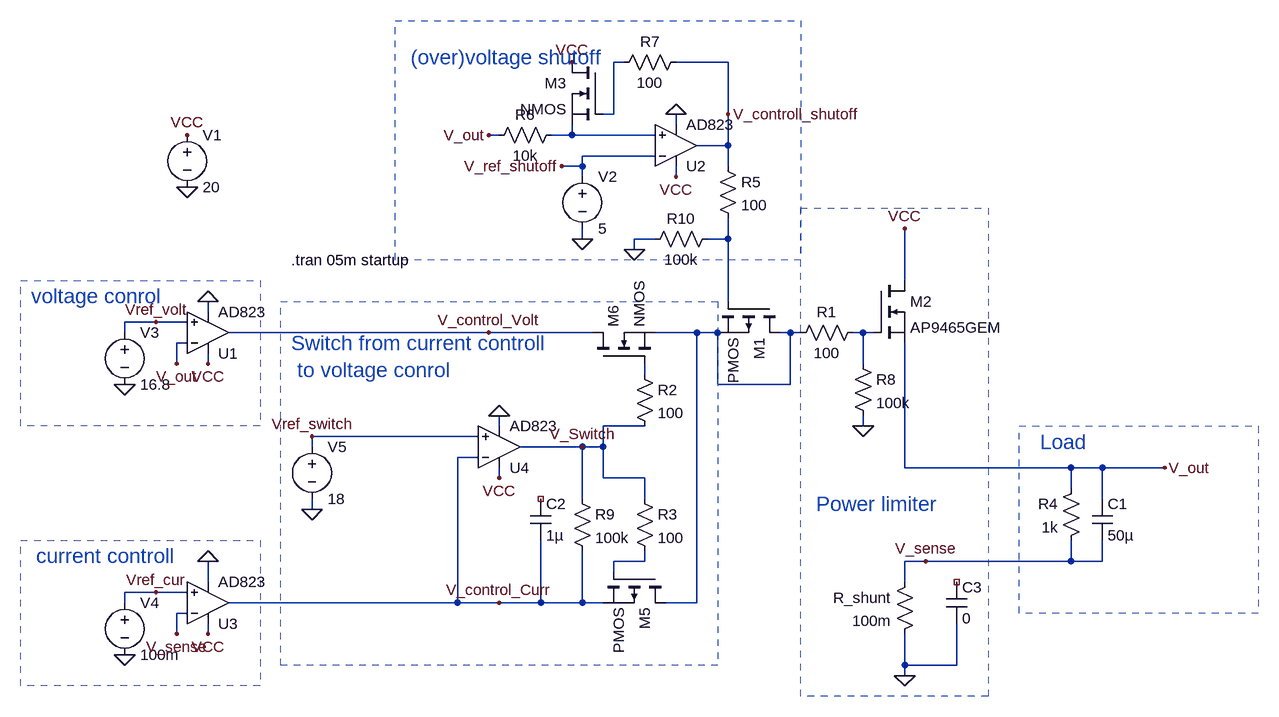
[diagram p0: schematic Lap_Power_supply.asc]
Lap_Power_supply.asc, the LTspice schematic file:
Version 4
SHEET 1 1484 1084
WIRE 400 -240 384 -240
WIRE 560 -240 480 -240
WIRE 384 -160 384 -240
WIRE 384 -160 368 -160
WIRE 560 -160 560 -240
WIRE 480 -144 480 -160
WIRE 208 -128 192 -128
WIRE 320 -128 320 -144
WIRE 320 -128 288 -128
WIRE 448 -128 320 -128
WIRE 560 -112 560 -160
WIRE 560 -112 512 -112
WIRE 448 -96 336 -96
WIRE 336 -80 336 -96
WIRE 336 -80 304 -80
WIRE 560 -80 560 -112
WIRE 336 -64 336 -80
WIRE 480 -64 480 -80
WIRE 336 32 336 16
WIRE 448 32 416 32
WIRE 560 32 560 0
WIRE 560 32 528 32
WIRE 416 48 416 32
WIRE 832 96 832 16
WIRE 560 128 560 32
WIRE -240 144 -240 128
WIRE -320 160 -368 160
WIRE -272 160 -320 160
WIRE -368 176 -368 160
WIRE 192 176 -208 176
WIRE 352 176 192 176
WIRE 512 176 448 176
WIRE 544 176 512 176
WIRE 656 176 640 176
WIRE 672 176 656 176
WIRE 768 176 752 176
WIRE 784 176 768 176
WIRE -272 192 -288 192
WIRE -288 224 -288 192
WIRE -240 224 -240 208
WIRE 768 224 768 176
WIRE 432 240 432 224
WIRE 544 256 544 176
WIRE 656 256 656 176
WIRE 656 256 544 256
WIRE 208 320 208 304
WIRE 432 320 368 320
WIRE 768 320 768 304
WIRE 176 336 -80 336
WIRE -80 352 -80 336
WIRE 336 352 240 352
WIRE 368 352 368 320
WIRE 368 352 336 352
WIRE 176 368 144 368
WIRE 832 384 832 192
WIRE 1088 384 832 384
WIRE 1136 384 1088 384
WIRE 1232 384 1136 384
WIRE 208 400 208 384
WIRE 368 400 368 352
WIRE 432 400 368 400
WIRE 1088 416 1088 384
WIRE 336 432 336 352
WIRE 432 432 432 400
WIRE 1136 432 1136 384
WIRE -80 448 -80 432
WIRE 432 528 432 512
WIRE 432 528 384 528
WIRE 864 528 832 528
WIRE 1088 528 1088 496
WIRE 1088 528 864 528
WIRE 1136 528 1136 496
WIRE 1136 528 1088 528
WIRE 384 544 384 528
WIRE -240 560 -240 528
WIRE 832 560 832 528
WIRE -320 576 -368 576
WIRE -272 576 -320 576
WIRE -368 592 -368 576
WIRE 144 592 144 368
WIRE 144 592 -208 592
WIRE 208 592 144 592
WIRE 272 592 272 496
WIRE 272 592 208 592
WIRE 336 592 336 512
WIRE 336 592 272 592
WIRE 368 592 336 592
WIRE 512 592 512 176
WIRE 512 592 464 592
WIRE -272 608 -288 608
WIRE -288 640 -288 608
WIRE -240 640 -240 624
WIRE 832 688 832 640
WIRE 912 688 912 624
WIRE 912 688 832 688
WIRE 832 704 832 688
FLAG 832 704 0
FLAG -240 128 0
FLAG 832 16 VCC
FLAG -240 224 VCC
FLAG -272 -128 VCC
FLAG -272 -48 0
FLAG -320 160 Vref_volt
FLAG 1232 384 V_out
FLAG -288 224 V_out
FLAG 864 528 V_sense
FLAG -368 256 0
FLAG -240 528 0
FLAG -240 640 VCC
FLAG -320 576 Vref_cur
FLAG -288 640 V_sense
FLAG -368 672 0
FLAG 208 304 0
FLAG 208 400 VCC
FLAG -80 336 Vref_switch
FLAG -80 448 0
FLAG 768 320 0
FLAG 336 352 V_Switch
FLAG 208 592 V_control_Curr
FLAG 192 176 V_control_Volt
FLAG 480 -160 0
FLAG 480 -64 VCC
FLAG 192 -128 V_out
FLAG 336 32 0
FLAG 304 -80 V_ref_shutoff
FLAG 560 -160 V_controll_shutoff
FLAG 416 48 0
FLAG 320 -240 VCC
SYMBOL res 768 160 R90
WINDOW 0 0 56 VBottom 2
WINDOW 3 32 56 VTop 2
SYMATTR InstName R1
SYMATTR Value 100
SYMBOL res 1104 400 M0
SYMATTR InstName R4
SYMATTR Value 1k
SYMBOL voltage -272 -144 R0
SYMATTR InstName V1
SYMATTR Value 20
SYMBOL res 848 544 M0
SYMATTR InstName R_shunt
SYMATTR Value 100m
SYMBOL OpAmps\\AD823 -240 240 M180
SYMATTR InstName U1
SYMBOL voltage -368 160 R0
SYMATTR InstName V3
SYMATTR Value 16.8
SYMBOL nmos 784 96 R0
SYMATTR InstName M2
SYMATTR Value AP9465GEM
SYMBOL res 416 224 R0
SYMATTR InstName R2
SYMATTR Value 100
SYMBOL OpAmps\\AD823 -240 656 M180
SYMATTR InstName U3
SYMBOL voltage -368 576 R0
SYMATTR InstName V4
SYMATTR Value 100m
SYMBOL OpAmps\\AD823 208 416 M180
SYMATTR InstName U4
SYMBOL voltage -80 336 R0
WINDOW 123 0 0 Left 0
WINDOW 39 0 0 Left 0
SYMATTR InstName V5
SYMATTR Value 18
SYMBOL res 416 416 R0
SYMATTR InstName R3
SYMATTR Value 100
SYMBOL pmos 464 544 R90
SYMATTR InstName M5
SYMBOL nmos 352 224 R270
SYMATTR InstName M6
SYMBOL cap 1120 432 R0
SYMATTR InstName C1
SYMATTR Value 50µ
SYMBOL res 752 208 R0
SYMATTR InstName R8
SYMATTR Value 100k
SYMBOL res 320 416 R0
SYMATTR InstName R9
SYMATTR Value 100k
SYMBOL OpAmps\\AD823 480 -48 M180
SYMATTR InstName U2
SYMBOL res 544 -96 R0
SYMATTR InstName R5
SYMATTR Value 100
SYMBOL voltage 336 -80 R0
WINDOW 123 0 0 Left 0
WINDOW 39 0 0 Left 0
SYMATTR InstName V2
SYMATTR Value 5
SYMBOL pmos 640 128 R90
SYMATTR InstName M1
SYMBOL res 304 -144 R90
WINDOW 0 0 56 VBottom 2
WINDOW 3 32 56 VTop 2
SYMATTR InstName R6
SYMATTR Value 10k
SYMBOL cap 256 432 R0
SYMATTR InstName C2
SYMATTR Value 1µ
SYMBOL res 432 48 R270
WINDOW 0 32 56 VTop 2
WINDOW 3 0 56 VBottom 2
SYMATTR InstName R10
SYMATTR Value 100k
SYMBOL cap 896 560 R0
SYMATTR InstName C3
SYMATTR Value 0
SYMBOL nmos 368 -240 M0
SYMATTR InstName M3
SYMBOL res 496 -256 R90
WINDOW 0 0 56 VBottom 2
WINDOW 3 32 56 VTop 2
SYMATTR InstName R7
SYMATTR Value 100
TEXT -112 64 Left 2 !.tran 05m startup
TEXT -112 192 Left 3 ;Switch from current controll\n to voltage conrol
TEXT -504 520 Left 3 ;current controll
TEXT -512 120 Left 3 ;voltage conrol
TEXT 72 -248 Left 3 ;(over)voltage shutoff
TEXT 696 440 Left 3 ;Power limiter
TEXT 1040 344 Left 3 ;Load
RECTANGLE Normal 672 64 48 -304 2
RECTANGLE Normal 544 688 -128 128 2
RECTANGLE Normal -160 320 -528 96 2
RECTANGLE Normal -160 720 -528 496 2
RECTANGLE Normal 960 736 672 -16 2
RECTANGLE Normal 1376 608 1008 320 2

The netlist it stands for:
* Lap_Power_supply.asc
R1 N005 N004 100
R4 V_out V_sense 1k
V1 VCC 0 20
R_shunt V_sense 0 100m
XU1 Vref_volt V_out VCC 0 V_control_Volt AD823  ; pins In+ In- V+ V- OUT
V3 Vref_volt 0 16.8
M2 VCC N005 V_out V_out AP9465GEM
R2 N006 V_Switch 100
XU3 Vref_cur V_sense VCC 0 V_control_Curr AD823  ; pins In+ In- V+ V- OUT
V4 Vref_cur 0 100m
XU4 Vref_switch V_control_Curr VCC 0 V_Switch AD823  ; pins In+ In- V+ V- OUT
V5 Vref_switch 0 18
R3 V_Switch N007 100
M5 N004 N007 V_control_Curr V_control_Curr PMOS
M6 V_control_Volt N006 N004 N004 NMOS
C1 V_out V_sense 50µ
R8 N005 0 100k
R9 V_Switch V_control_Curr 100k
XU2 N002 V_ref_shutoff VCC 0 V_controll_shutoff AD823  ; pins In+ In- V+ V- OUT
R5 V_controll_shutoff N003 100
V2 V_ref_shutoff 0 5
M1 N004 N003 N004 N004 PMOS
R6 N002 V_out 10k
C2 NC_01 V_control_Curr 1µ
R10 0 N003 100k
C3 NC_02 0 0
M3 VCC N001 N002 N002 NMOS
R7 V_controll_shutoff N001 100
.model NMOS NMOS
.model PMOS PMOS
.lib standard.mos
.tran 05m startup
* Switch from current controll
*  to voltage conrol
* current controll
* voltage conrol
* (over)voltage shutoff
* Power limiter
* Load
.lib ADI.lib
.backanno
.end